# Altium project RGB.PrjPcb
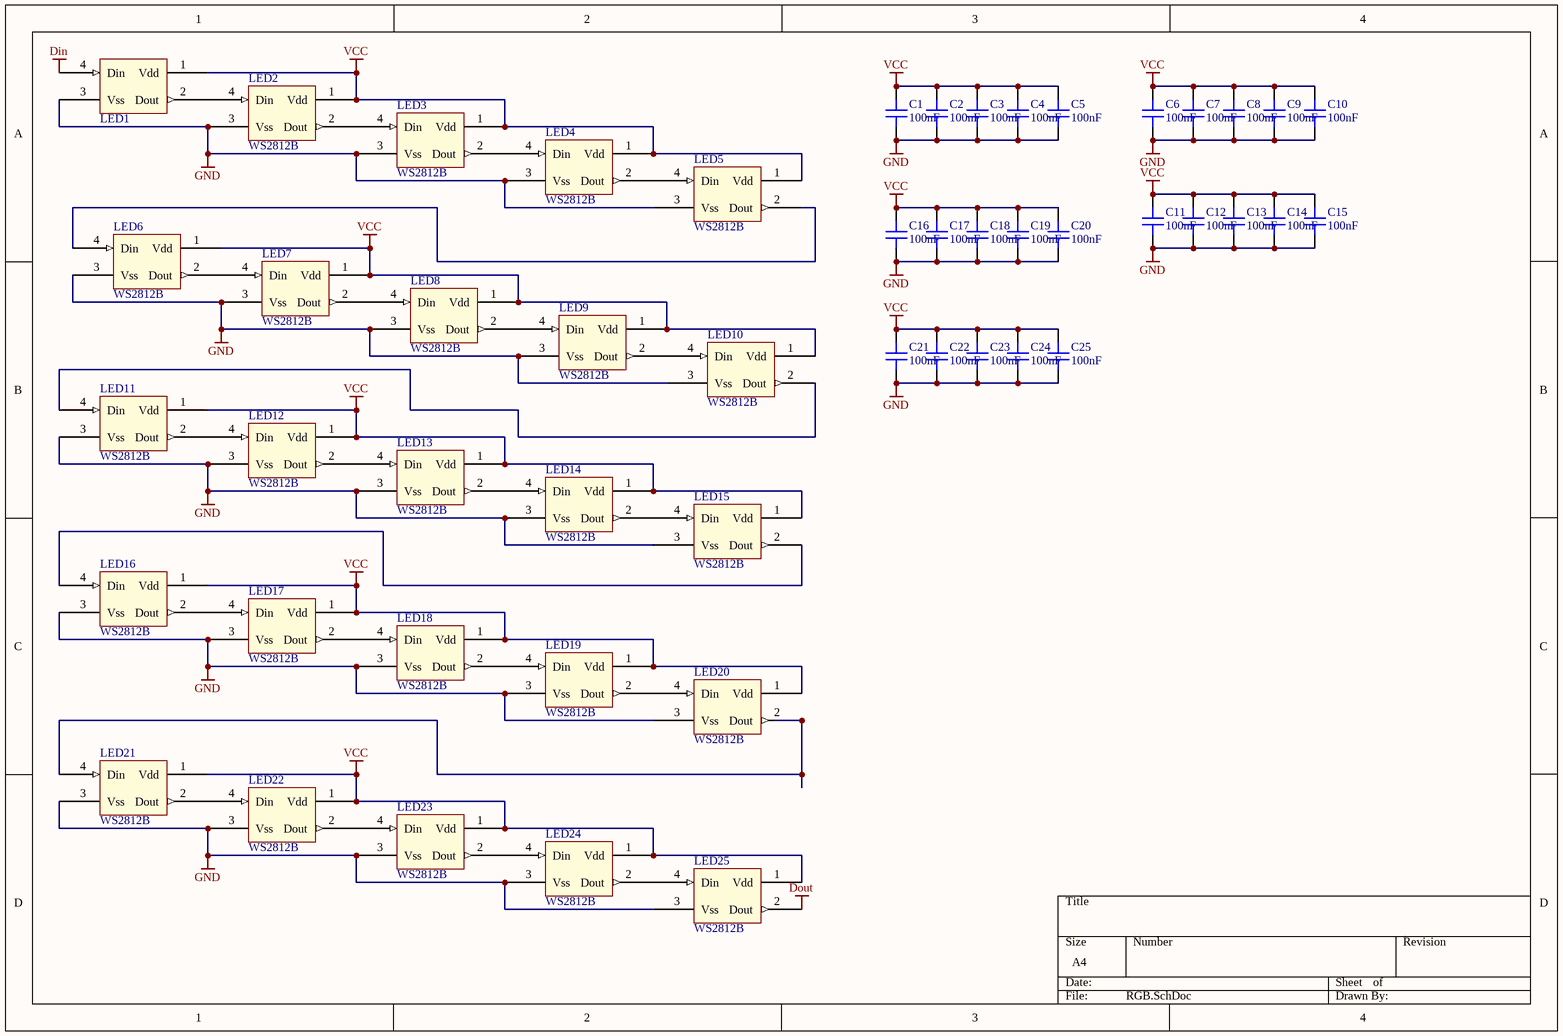
[diagram p0: RGB.SchDoc]
1 sheet, 50 parts. Net scope: global (net labels, ports and power ports of the same name join across sheets).
Board file: RGB.PcbDoc

## Sheet RGB.SchDoc
size A4

### Parts
C1  100nF  [CAP 1206/3216]
C2  100nF  [CAP 1206/3216]
C3  100nF  [CAP 1206/3216]
C4  100nF  [CAP 1206/3216]
C5  100nF  [CAP 1206/3216]
C6  100nF  [CAP 1206/3216]
C7  100nF  [CAP 1206/3216]
C8  100nF  [CAP 1206/3216]
C9  100nF  [CAP 1206/3216]
C10  100nF  [CAP 1206/3216]
C11  100nF  [CAP 1206/3216]
C12  100nF  [CAP 1206/3216]
C13  100nF  [CAP 1206/3216]
C14  100nF  [CAP 1206/3216]
C15  100nF  [CAP 1206/3216]
C16  100nF  [CAP 1206/3216]
C17  100nF  [CAP 1206/3216]
C18  100nF  [CAP 1206/3216]
C19  100nF  [CAP 1206/3216]
C20  100nF  [CAP 1206/3216]
C21  100nF  [CAP 1206/3216]
C22  100nF  [CAP 1206/3216]
C23  100nF  [CAP 1206/3216]
C24  100nF  [CAP 1206/3216]
C25  100nF  [CAP 1206/3216]
LED1  WS2812B  [WS2812B]  (value not drawn)
LED2  WS2812B  [WS2812B]
LED3  WS2812B  [WS2812B]
LED4  WS2812B  [WS2812B]
LED5  WS2812B  [WS2812B]
LED6  WS2812B  [WS2812B]
LED7  WS2812B  [WS2812B]
LED8  WS2812B  [WS2812B]
LED9  WS2812B  [WS2812B]
LED10  WS2812B  [WS2812B]
LED11  WS2812B  [WS2812B]
LED12  WS2812B  [WS2812B]
LED13  WS2812B  [WS2812B]
LED14  WS2812B  [WS2812B]
LED15  WS2812B  [WS2812B]
LED16  WS2812B  [WS2812B]
LED17  WS2812B  [WS2812B]
LED18  WS2812B  [WS2812B]
LED19  WS2812B  [WS2812B]
LED20  WS2812B  [WS2812B]
LED21  WS2812B  [WS2812B]
LED22  WS2812B  [WS2812B]
LED23  WS2812B  [WS2812B]
LED24  WS2812B  [WS2812B]
LED25  WS2812B  [WS2812B]

### Nets
Din: LED1.4(Din)
Dout: LED25.2(Dout)
GND: C1.1 C2.1 C3.1 C4.1 C5.1 C6.1 C7.1 C8.1 C9.1 C10.1 C11.1 C12.1 C13.1 C14.1 C15.1 C16.1 C17.1 C18.1 C19.1 C20.1 C21.1 C22.1 C23.1 C24.1 C25.1 LED1.3(Vss) LED2.3(Vss) LED3.3(Vss) LED4.3(Vss) LED5.3(Vss) LED6.3(Vss) LED7.3(Vss) LED8.3(Vss) LED9.3(Vss) LED10.3(Vss) LED11.3(Vss) LED12.3(Vss) LED13.3(Vss) LED14.3(Vss) LED15.3(Vss) LED16.3(Vss) LED17.3(Vss) LED18.3(Vss) LED19.3(Vss) LED20.3(Vss) LED21.3(Vss) LED22.3(Vss) LED23.3(Vss) LED24.3(Vss) LED25.3(Vss)
VCC: C1.2 C2.2 C3.2 C4.2 C5.2 C6.2 C7.2 C8.2 C9.2 C10.2 C11.2 C12.2 C13.2 C14.2 C15.2 C16.2 C17.2 C18.2 C19.2 C20.2 C21.2 C22.2 C23.2 C24.2 C25.2 LED1.1(Vdd) LED2.1(Vdd) LED3.1(Vdd) LED4.1(Vdd) LED5.1(Vdd) LED6.1(Vdd) LED7.1(Vdd) LED8.1(Vdd) LED9.1(Vdd) LED10.1(Vdd) LED11.1(Vdd) LED12.1(Vdd) LED13.1(Vdd) LED14.1(Vdd) LED15.1(Vdd) LED16.1(Vdd) LED17.1(Vdd) LED18.1(Vdd) LED19.1(Vdd) LED20.1(Vdd) LED21.1(Vdd) LED22.1(Vdd) LED23.1(Vdd) LED24.1(Vdd) LED25.1(Vdd)
NetLED1_2: LED1.2(Dout) LED2.4(Din)
NetLED2_2: LED2.2(Dout) LED3.4(Din)
NetLED3_2: LED3.2(Dout) LED4.4(Din)
NetLED4_2: LED4.2(Dout) LED5.4(Din)
NetLED5_2: LED5.2(Dout) LED6.4(Din)
NetLED6_2: LED6.2(Dout) LED7.4(Din)
NetLED7_2: LED7.2(Dout) LED8.4(Din)
NetLED8_2: LED8.2(Dout) LED9.4(Din)
NetLED9_2: LED9.2(Dout) LED10.4(Din)
NetLED10_2: LED10.2(Dout) LED11.4(Din)
NetLED11_2: LED11.2(Dout) LED12.4(Din)
NetLED12_2: LED12.2(Dout) LED13.4(Din)
NetLED13_2: LED13.2(Dout) LED14.4(Din)
NetLED14_2: LED14.2(Dout) LED15.4(Din)
NetLED15_2: LED15.2(Dout) LED16.4(Din)
NetLED16_2: LED16.2(Dout) LED17.4(Din)
NetLED17_2: LED17.2(Dout) LED18.4(Din)
NetLED18_2: LED18.2(Dout) LED19.4(Din)
NetLED19_2: LED19.2(Dout) LED20.4(Din)
NetLED20_2: LED20.2(Dout) LED21.4(Din)
NetLED21_2: LED21.2(Dout) LED22.4(Din)
NetLED22_2: LED22.2(Dout) LED23.4(Din)
NetLED23_2: LED23.2(Dout) LED24.4(Din)
NetLED24_2: LED24.2(Dout) LED25.4(Din)

### Library data of the parts
C1-C25 = Capacitor: SMT Capacitor; Value: 0.1uF